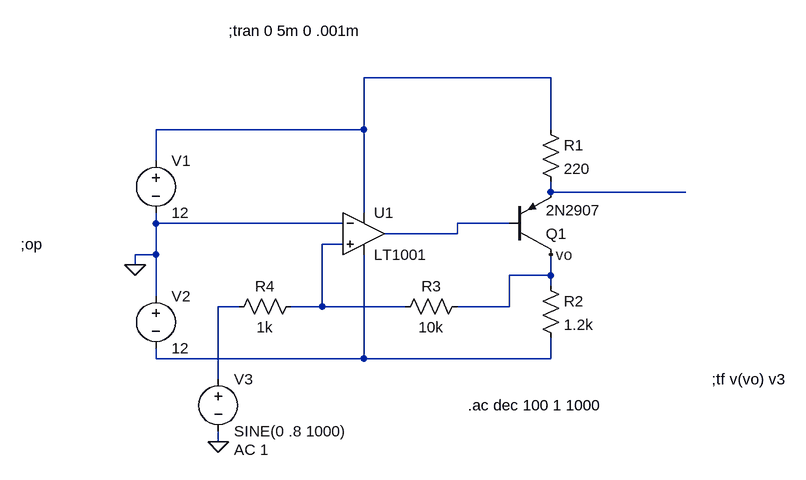
[diagram p0: schematic real_final1.asc]
real_final1.asc, the LTspice schematic file:
Version 4
SHEET 1 884 680
WIRE 496 -80 208 -80
WIRE 208 0 208 -80
WIRE 208 0 -112 0
WIRE 496 0 496 -80
WIRE -112 48 -112 0
WIRE 496 96 496 80
WIRE 528 96 496 96
WIRE 704 96 528 96
WIRE 208 128 208 0
WIRE -112 144 -112 128
WIRE 176 144 -112 144
WIRE 368 144 352 144
WIRE 432 144 368 144
WIRE 352 160 352 144
WIRE 352 160 240 160
WIRE 176 176 144 176
WIRE -112 192 -112 144
WIRE -112 192 -144 192
WIRE -144 208 -144 192
WIRE 480 224 432 224
WIRE 496 224 496 192
WIRE 496 224 480 224
WIRE 496 240 496 224
WIRE -112 256 -112 192
WIRE 16 272 -16 272
WIRE 144 272 144 176
WIRE 144 272 96 272
WIRE 160 272 144 272
WIRE 272 272 160 272
WIRE 432 272 432 224
WIRE 432 272 352 272
WIRE -112 352 -112 336
WIRE 208 352 208 192
WIRE 208 352 -112 352
WIRE 496 352 496 320
WIRE 496 352 208 352
WIRE -16 384 -16 272
WIRE -16 480 -16 464
FLAG -144 208 0
FLAG -16 480 0
FLAG 496 192 vo
DATAFLAG 480 224 ""
DATAFLAG 160 272 ""
DATAFLAG 368 144 ""
DATAFLAG 528 96 ""
SYMBOL voltage -112 32 R0
WINDOW 123 0 0 Left 2
WINDOW 39 0 0 Left 2
SYMATTR InstName V1
SYMATTR Value 12
SYMBOL voltage -112 240 R0
WINDOW 123 0 0 Left 2
WINDOW 39 0 0 Left 2
SYMATTR InstName V2
SYMATTR Value 12
SYMBOL pnp 432 192 M180
SYMATTR InstName Q1
SYMATTR Value 2N2907
SYMBOL res 480 -16 R0
SYMATTR InstName R1
SYMATTR Value 220
SYMBOL res 480 224 R0
SYMATTR InstName R2
SYMATTR Value 1.2k
SYMBOL res 368 256 R90
WINDOW 0 0 56 VBottom 2
WINDOW 3 32 56 VTop 2
SYMATTR InstName R3
SYMATTR Value 10k
SYMBOL res 112 256 R90
WINDOW 0 0 56 VBottom 2
WINDOW 3 32 56 VTop 2
SYMATTR InstName R4
SYMATTR Value 1k
SYMBOL voltage -16 368 R0
WINDOW 123 24 124 Left 2
WINDOW 39 0 0 Left 2
SYMATTR InstName V3
SYMATTR Value SINE(0 .8 1000)
SYMATTR Value2 AC 1
SYMBOL Opamps\\LT1001 208 96 R0
SYMATTR InstName U1
TEXT -320 176 Left 2 !;op
TEXT 0 -152 Left 2 !;tran 0 5m 0 .001m
TEXT 744 384 Left 2 !;tf v(vo) v3
TEXT 368 424 Left 2 !.ac dec 100 1 1000

The netlist it stands for:
* real_final1.asc
V1 N001 0 12
V2 0 N006 12
Q1 vo N003 N002 0 2N2907
R1 N001 N002 220
R2 vo N006 1.2k
R3 vo N004 10k
R4 N004 N005 1k
V3 N005 0 SINE(0 .8 1000) AC 1
XU1 N004 0 N001 N006 N003 LT1001  ; pins In+ In- V+ V- OUT
.model NPN NPN
.model PNP PNP
.lib standard.bjt
;op
;tran 0 5m 0 .001m
;tf v(vo) v3
.ac dec 100 1 1000
.lib LTC.lib
.backanno
.end